# EAGLE design SWD2TC (EAGLE 7.4.0)
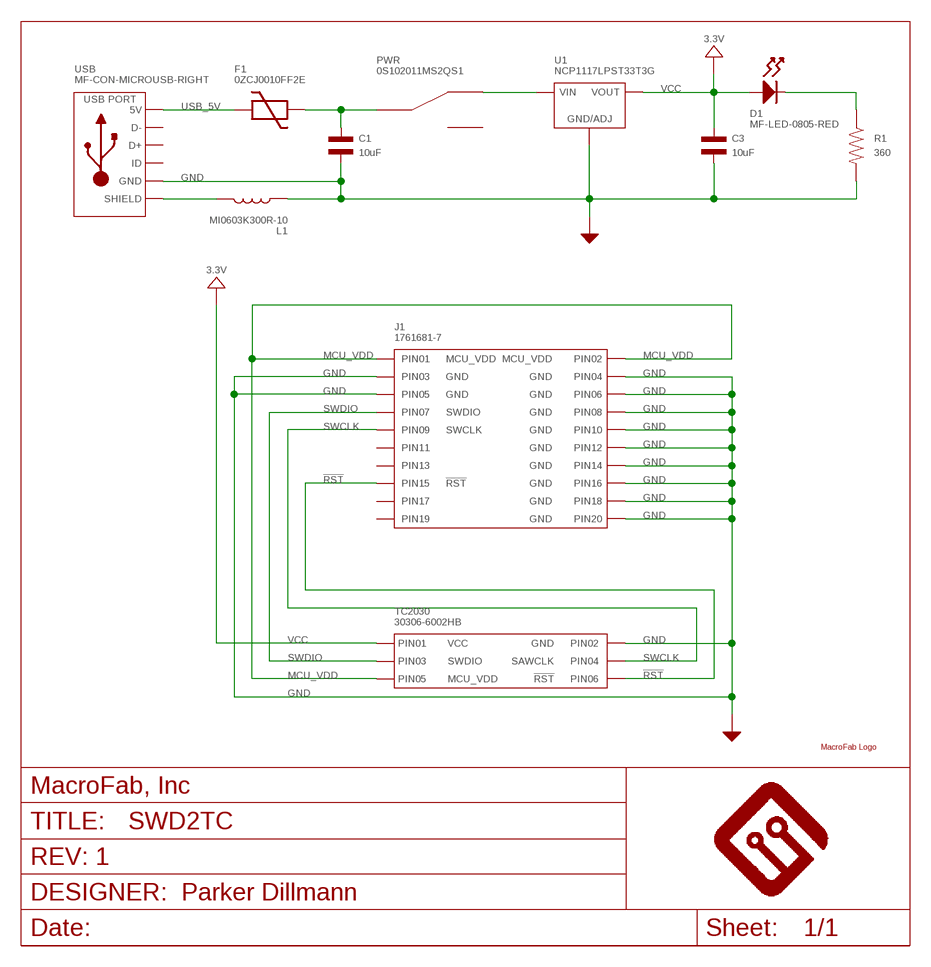
[diagram p0: schematic, sheet 1]

## Parts
C1  10uF  CAPACITOR_NP_1206  [C1206]
C3  10uF  CAPACITOR_NP_1206  [C1206]
D1  MF-LED-0805-RED  LED_SINGLE-0805-RED  [LED0805]
F1  0ZCJ0010FF2E  PTC_FUSE_1206  [1206]
FRAME1  MF_FRAMEDEFAULT  [MF_FRAME_DEFAULT]
J1  1761681-7  CON_02X10_1761681-7  [1761681-7]
L1  MI0603K300R-10  INDUCTOR_0603  [L0603]
PWR  0S102011MS2QS1  SPDT_0S102011MS2QS1  [0S102011MS2QS1]
R1  360  RESISTOR_0805  [R0805]
TC2030  30306-6002HB  CON_02X03_30306-6002HB  [30306-6002HB]
U1  NCP1117LPST33T3G  [SOT-223-3]
U$3  MF_LOGOLOGO_MEDIUM  [MF_LOGO_MEDIUM]
USB  MF-CON-MICROUSB-RIGHT  USB_MICRO_RIGHT  [MICROUSB-RIGHT]

## Nets
!RST: J1.P$15 TC2030.6(PIN6)
GND: C1.P$2 C3.P$2 J1.P$3 J1.P$4 J1.P$5 J1.P$6 J1.P$8 J1.P$10 J1.P$12 J1.P$14 J1.P$16 J1.P$18 J1.P$20 L1.P$1 R1.P$2 TC2030.2(PIN2) U1.P$2(GND/ADJ) USB.5(GND)
MCU_VDD: J1.P$1 J1.P$2 TC2030.5(PIN5)
N$1: D1.CATHODE R1.P$1
N$2: C1.P$1 F1.2 PWR.2(C)
N$4: L1.P$2 USB.S1(SLD) USB.S2(SLD) USB.S3(SLD) USB.S4(SLD) USB.S5(SLD) USB.S6(SLD)
N$5: PWR.1 U1.P$4(VIN)
SWCLK: J1.P$9 TC2030.4(PIN4)
SWDIO: J1.P$7 TC2030.3(PIN3)
USB_5V: F1.1 USB.1(5V)
VCC: C3.P$1 D1.ANODE TC2030.1(PIN1) U1.P$1(VOUT) U1.P$3(VOUT) ; supply symbol labelled 3.3V
Unconnected: J1.P$11 J1.P$13 J1.P$17 J1.P$19 PWR.3 USB.2(D-) USB.3(D+) USB.4(ID)

## Library data of the parts
C1 C3 = MF_Passives:CAPACITOR_NP: Library: MF_Passives Description: Device for Non-Polarized Capacitors. Manufacture part number (MPN) can be added via Attributes. Check https://factory.macrofab.com/parts for the house parts list.; MPN: MF-CAP-1206-10uF; POPULATE: 1
D1 = MF_LEDs:LED_SINGLE: Library: MF_LEDs Description: Device for Single LED Packages. Manufacture part number (MFG#) can be added via Attributes.; HOUSEPART: YES; MPN: MF-LED-0805-RED; POPULATE: 1; URL: https://factory.macrofab.com/part/MF-LED-0805-RED
F1 = PP_Passives:PTC_FUSE; MPN: 0ZCJ0010FF2E; POPULATE: 1
FRAME1 = MF_Aesthetics:MF_FRAME: Library: MF_Aesthetics Description: Frame for adding Meta Data to the PCB and Schematic.; DNAME: Parker Dillmann; HOUSEPART: 0; POPULATE: 0; REVNUM: REV: 1
J1 = PP_Connectors:CON_02X10; LABEL01: MCU_VDD; LABEL02: MCU_VDD; LABEL03: GND; LABEL04: GND; LABEL05: GND; LABEL06: GND; LABEL07: SWDIO; LABEL08: GND; LABEL09: SWCLK; LABEL10: GND; LABEL12: GND; LABEL14: GND; LABEL15: !RST; LABEL16: GND; LABEL18: GND; LABEL20: GND
L1 = MF_Passives:INDUCTOR: Library: MF_Passives Description: Device for Inductors. Manufacture part number (MPN) can be added via Attributes. Check https://factory.macrofab.com/parts for the house parts list.; MPN: MI0603K300R-10; POPULATE: 1
PWR = PP_Electromechanical:SPDT; MPN: 0S102011MS2QS1; POPULATE: 1
R1 = MF_Passives:RESISTOR: Library: MF_Passives Description: Device for Resistors. Manufacture part number (MPN), Voltage, Tolerance, and Wattage Rating can be added via Attributes. Check https://factory.macrofab.com/parts for the house parts list.; MPN: MF-RES-0805-360; POPULATE: 1
TC2030 = PP_Connectors:CON_02X03; LABEL01: VCC; LABEL02: GND; LABEL03: SWDIO; LABEL04: SAWCLK; LABEL05: MCU_VDD; LABEL06: !RST; MPN: 30306-6002HB; POPULATE: 1
U1 = MF_IC_Power:NCP1117LP: Manufacturer Part #: NCP1117LP Manufacturer: ON Semiconductor Description: LDO Voltage Regulators; HOUSEPART: NO; MPN: NCP1117LPST33T3G; POPULATE: 1; URL: http://www.onsemi.com/pub_link/Collateral/NCP1117LP-D.PDF
U$3 = PP_Aesthetics:MF_LOGO; POPULATE: 0
USB = MF_Connectors:USB: Library: MF_Connectors Description: 5 Pin USB Connectors. SLD is the shield connection. Usually tied to ground through a small ferrite bead.; HOUSEPART: YES; MPN: MF-CON-MICROUSB-RIGHT; POPULATE: 1; URL: https://factory.macrofab.com/part/MF-CON-MICROUSB-RIGHT

## Board
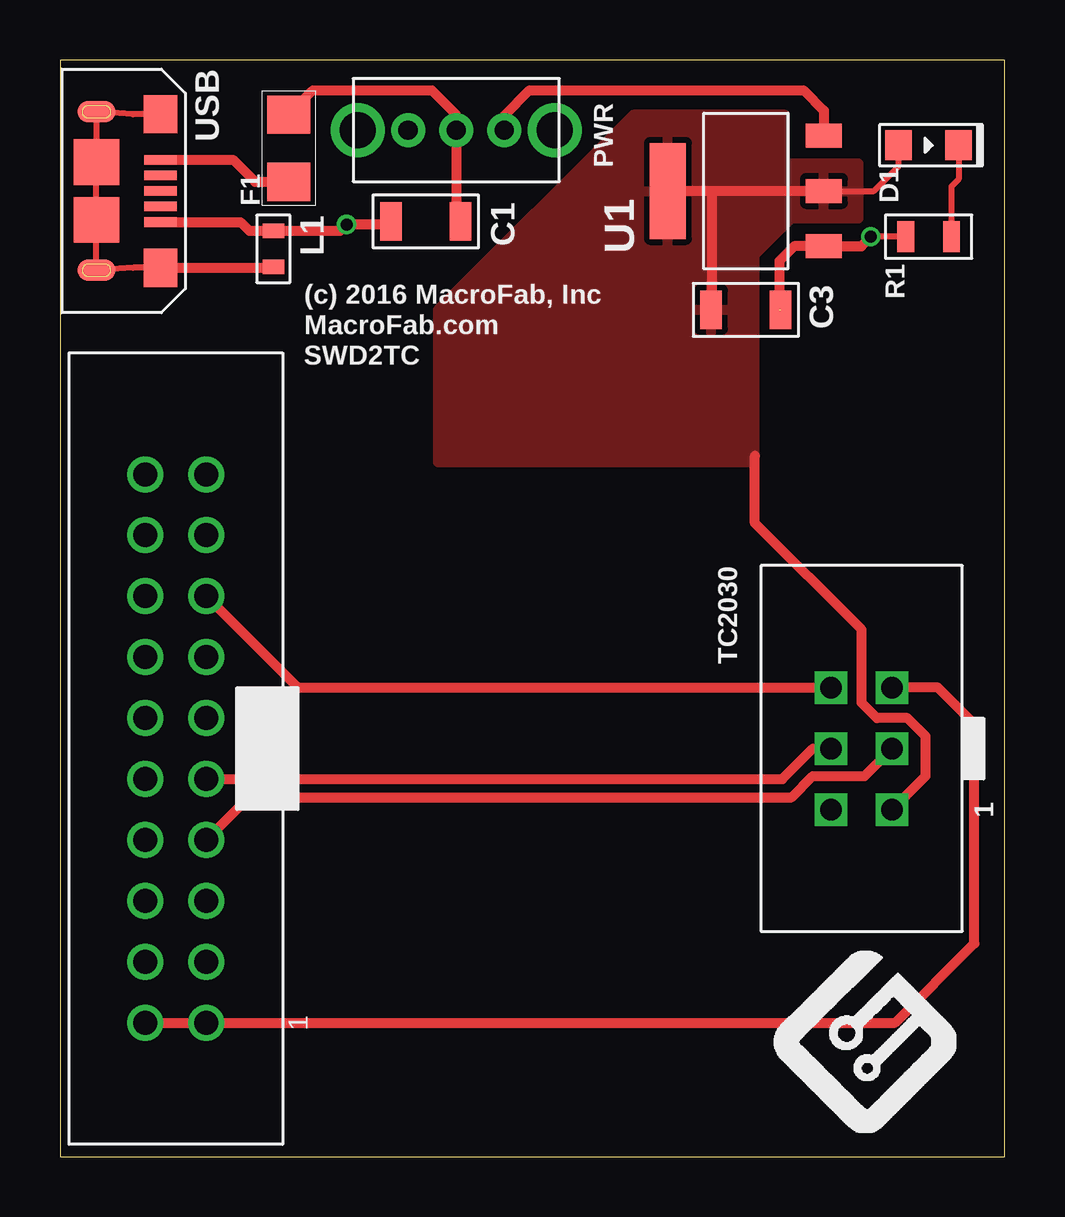
[diagram p1: board, top side]
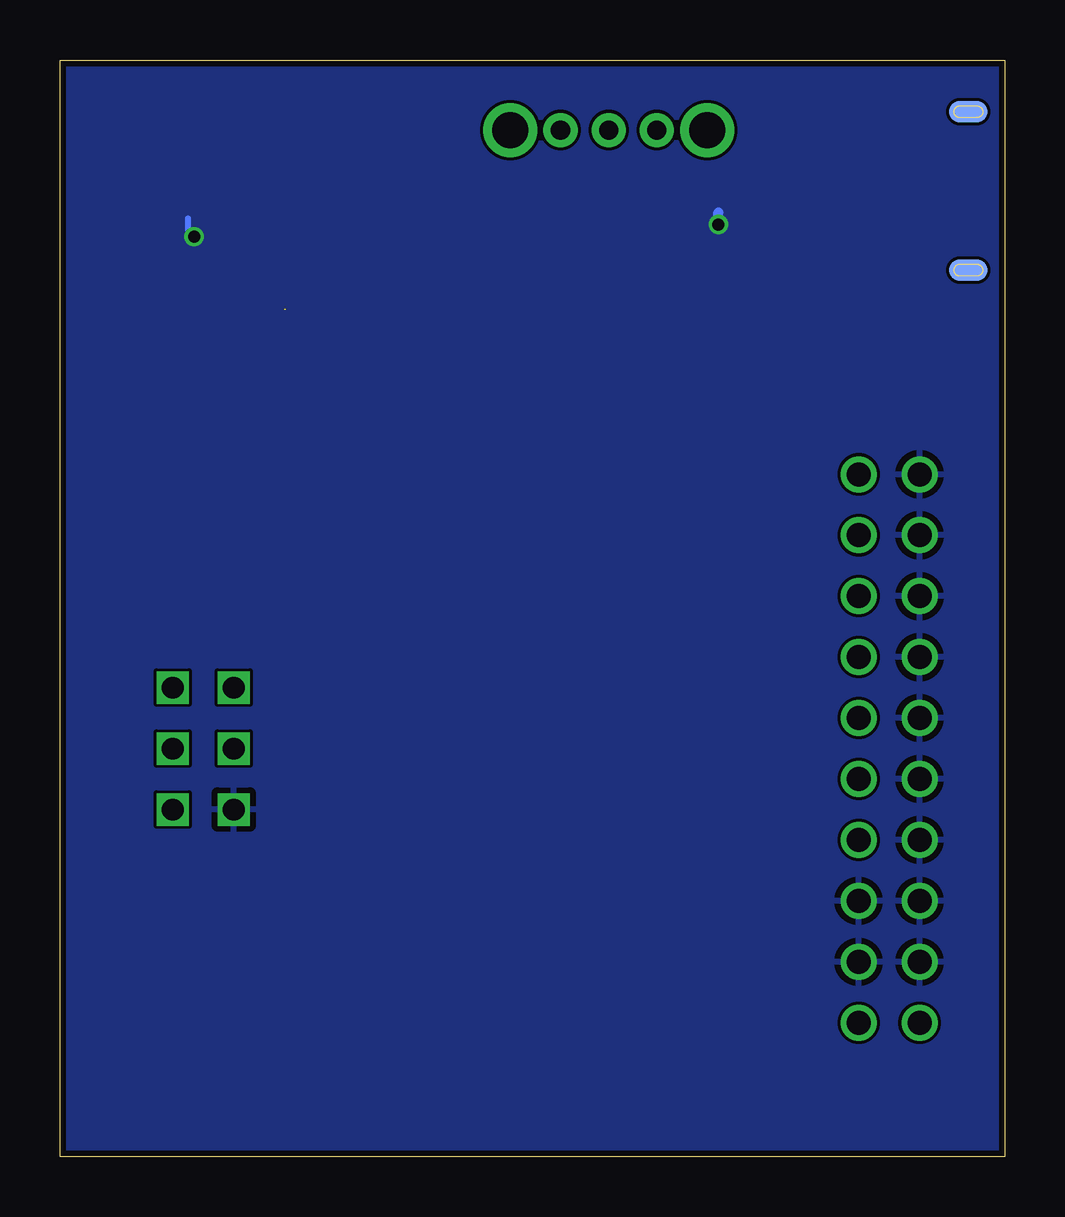
[diagram p2: board, bottom side, seen from below]

Size 39.37 x 45.72 mm. Coordinates in mm from the lower left corner, seen from the top.
Outline: 0,0 39.37,0 39.37,45.72 0,45.72 0,0
Copper layers (1*16): Top 0.035mm / dielectric 1.5mm / Bottom 0.035mm
Design rules "MF_Standard_2_Layer": minimum track width 5mil, minimum drill 12mil, track to track 5mil, track to pad 5mil, pad to pad 5mil, via to via 5mil, smd to smd 0mil, copper to edge 10mil, drill to drill 10mil, minimum pad ring 6mil, minimum via ring 6mil, stop-mask expansion 2mil, vias tented up to drill 25mil, thermal gap 10mil

### Footprints (pad centres in the part's own frame; a part is rotated, then mirrored left to right if it is on the bottom)
C1206 = smd 0.9 x 1.6: P$1 -1.45,0; P$2 1.45,0
LED0805 = smd 1.1 x 1.25: ANODE 1.25,0; CATHODE -1.25,0
1206 = smd 1.6 x 1.8: 1 -1.4,0; 2 1.4,0
1761681-7 = drill 1: P$1 -1.27,11.43; P$2 1.27,11.43; P$3 -1.27,8.89; P$4 1.27,8.89; P$5 -1.27,6.35; P$6 1.27,6.35; P$7 -1.27,3.81; P$8 1.27,3.81; P$9 -1.27,1.27; P$10 1.27,1.27; P$11 -1.27,-1.27; P$12 1.27,-1.27; P$13 -1.27,-3.81; P$14 1.27,-3.81; P$15 -1.27,-6.35; P$16 1.27,-6.35; P$17 -1.27,-8.89; P$18 1.27,-8.89; P$19 -1.27,-11.43; P$20 1.27,-11.43
L0603 = smd 0.6 x 0.9: P$1 -0.75,0; P$2 0.75,0
0S102011MS2QS1 = drill 0.8 pad 1.422: 1 -2.007,0; 2 0,0; 3 2.007,0 | drill 1.5 pad 2.184: P$4 -4.102,0; P$5 4.102,0
R0805 = smd 0.7 x 1.3: P$1 -0.95,0; P$2 0.95,0
30306-6002HB = drill 0.9 square: 1 2.54,1.27; 2 2.54,-1.27; 3 0,1.27; 4 0,-1.27; 5 -2.54,1.27; 6 -2.54,-1.27
SOT-223-3 = smd 1.5 x 4: P$1 3.25,0 | smd 1.5 x 1: P$2 -3.25,2.3; P$3 -3.25,0; P$4 -3.25,-2.3
MICROUSB-RIGHT = smd 0.4 x 1.35: 1 -1.3,1.27; 2 -0.65,1.27; 3 0,1.27; 4 0.65,1.27; 5 1.3,1.27 | smd 0.9 x 1.6: S1 -3.3,-1.4; S2 3.3,-1.4 | smd 1.6 x 1.4: S3 -3.2,1.27; S4 3.2,1.27 | smd 1.9 x 1.9: S5 -1.2,-1.405; S6 1.2,-1.405 | smd 0.9 x 1.6 bottom: S7 -3.3,-1.4; S8 3.3,-1.4

### Placement (x,y rotation side)
C1  15.24,38.99 180 top
C3  28.57,35.31 0 top
D1  36.2,42.16 180 top
F1  9.53,42.04 90 top
FRAME1  10.16,36.83 0 top
J1  4.83,17.02 180 top
L1  8.89,37.85 270 top
PWR  16.51,42.8 180 top
R1  36.2,38.35 180 top
TC2030  33.4,17.02 270 top
U1  28.57,40.26 180 top
U$3  37.34,1.02 90 top
USB  2.92,40.26 270 top

### Tracks (layer width: path | path; a pad name or v marks a point on that pad's centre or on a via)
!RST
  Top 0.406: J1.P$15 9.91,19.56 TC2030.6
GND  (via drill 0.5)  (1 unrouted)
  Top 0.254: R1.P$2 v33.78,38.35
  Top 0.406: 13.79,38.86 v11.94,38.86 11.67,38.6 L1.P$1 7.89,38.6 7.52,38.96 USB.5 | v33.78,38.35 33.39,37.96 U1.P$2 30.59,37.96 29.97,37.34 29.97,35.31 | 13.84,38.86 13.79,38.86 | 13.79,38.86 C1.P$2
  Bottom 0.254: v33.78,38.35 34.04,38.61 34.04,39.12
  Bottom 0.406: v11.94,38.86 11.94,39.37
  pour Bottom: 0,45.72 39.37,45.72 39.37,0 0,0
MCU_VDD
  Top 0.406: J1.P$2 J1.P$1 34.8,5.59 38.1,8.89 38.1,18.03 36.58,19.56 TC2030.5
N$1
  Top 0.254: D1.CATHODE 37.45,40.75 37.15,40.45 R1.P$1
N$2
  Top 0.406: F1.2 10.54,44.45 15.49,44.45 16.51,43.43 PWR.2 16.51,38.99 C1.P$1
N$4
  Top 0.254: USB.S4 3.04,37.06 USB.S2 1.52,37.21 USB.S6 USB.S5 USB.S1 3.04,43.46 USB.S3
  Top 0.406: USB.S4 8.85,37.06 L1.P$2
N$5
  Top 0.406: PWR.1 18.54,42.82 18.54,43.43 19.56,44.45 30.99,44.45 31.82,43.61 U1.P$4
SWCLK
  Top 0.406: J1.P$9 30.1,15.75 31.37,17.02 TC2030.4
SWDIO
  Top 0.406: J1.P$7 7.87,14.99 30.48,14.99 31.37,15.88 33.53,15.88 TC2030.3
USB_5V
  Top 0.406: USB.1 7.21,41.56 8.13,40.64 F1.1
VCC
  Top 0.254: U1.P$3 33.91,40.26 34.95,41.3 D1.ANODE
  Top 0.406: U1.P$3 27.18,40.26 | 27.18,40.26 U1.P$1 | C3.P$1 27.18,35.31 27.18,40.26 | TC2030.1 36.07,15.88 36.07,17.53 35.31,18.29 34.04,18.29 33.4,18.92 33.4,21.97 28.96,26.42 28.96,29.21
  pour Top: 30.23,43.43 23.88,43.43 15.75,35.31 15.75,28.96 28.96,28.96 28.96,37.59 30.48,39.12 33.27,39.12 33.27,41.4 30.23,41.4